# EAGLE design curvetracer (EAGLE 6.4)
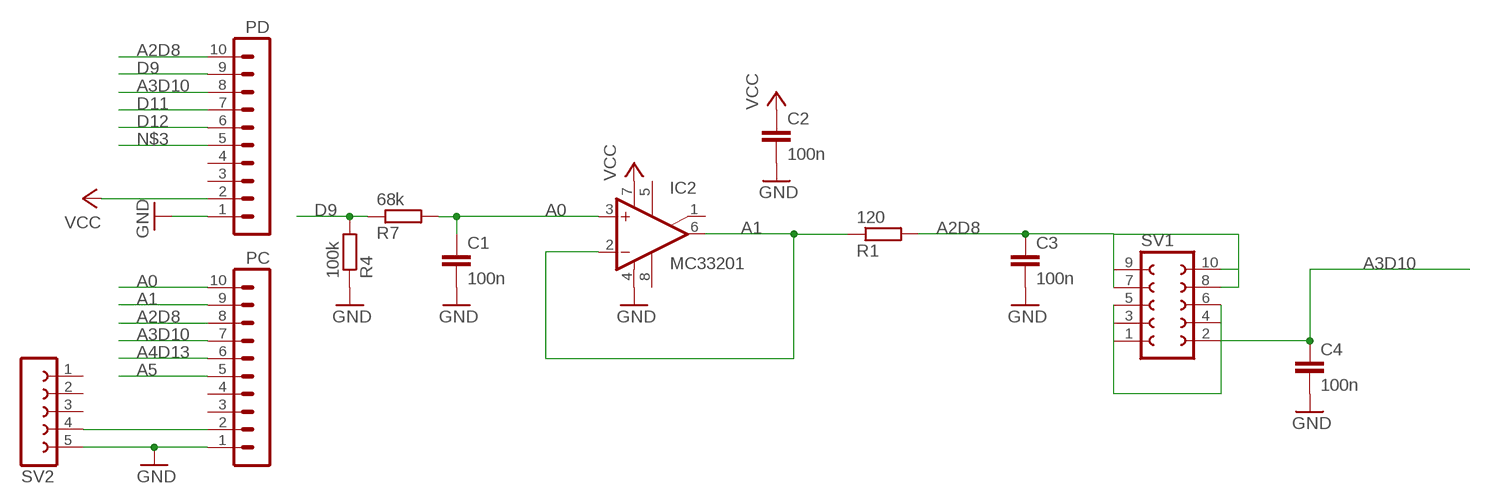
[diagram p0: schematic, sheet 1]

## Parts
C1  100n  C-EU025-024X044  [C025-024X044]
C2  100n  C-EU025-024X044  [C025-024X044]
C3  100n  C-EU075-032X103  [C075-032X103]
C4  100n  C-EU102-043X133  [C102-043X133]
IC2  MC33201  CA3130N  [DIL08]
PC  MA10-1W  [MA10-1W]
PD  MA10-1W  [MA10-1W]
R1  120  R-EU_R1206  [R1206]
R4  100k  R-EU_R1206  [R1206]
R7  68k  R-EU_R1206  [R1206]
SV1  FE05-2W  [FE05-2W]
SV2  FE05W  [FE05W]

## Nets
A0: C1.1 IC2.3(+IN) PC.10 R7.2
A1: IC2.2(-IN) IC2.6(OUT) PC.9 R1.1
A2D8: C3.1 PC.8 PD.10 R1.2 SV1.7 SV1.8 SV1.9 SV1.10
A3D10: C4.1 PC.7 PD.8 SV1.1 SV1.2 SV1.3 SV1.4 SV1.5 SV1.6
A4D13: PC.6
A5: PC.5
D9: PD.9 R4.2 R7.1
D11: PD.7
D12: PD.6
GND: C1.2 C2.2 C3.2 C4.2 IC2.4(V-) PC.1 PD.1 R4.1 SV2.5
N$1: PC.2 SV2.4
N$3: PD.5
VCC: C2.1 IC2.7(V+) PD.2
Unconnected: IC2.1(ON/CMP) IC2.5(ON) IC2.8(CMP) PC.3 PC.4 PD.3 PD.4 SV2.1 SV2.2 SV2.3

## Library data of the parts
C1-C4 = rcl:C-EU: CAPACITOR, European symbol
IC2 = linear:CA3130: OP AMP
PC PD = con-lstb:MA10-1W: PIN HEADER
R1 R4 R7 = rcl:R-EU_: RESISTOR, European symbol
SV1 = con-lsta:FE05-2W: FEMALE HEADER; OC_FARNELL: unknown; OC_NEWARK: unknown
SV2 = con-lsta:FE05W: FEMALE HEADER; OC_FARNELL: unknown; OC_NEWARK: unknown

## Board
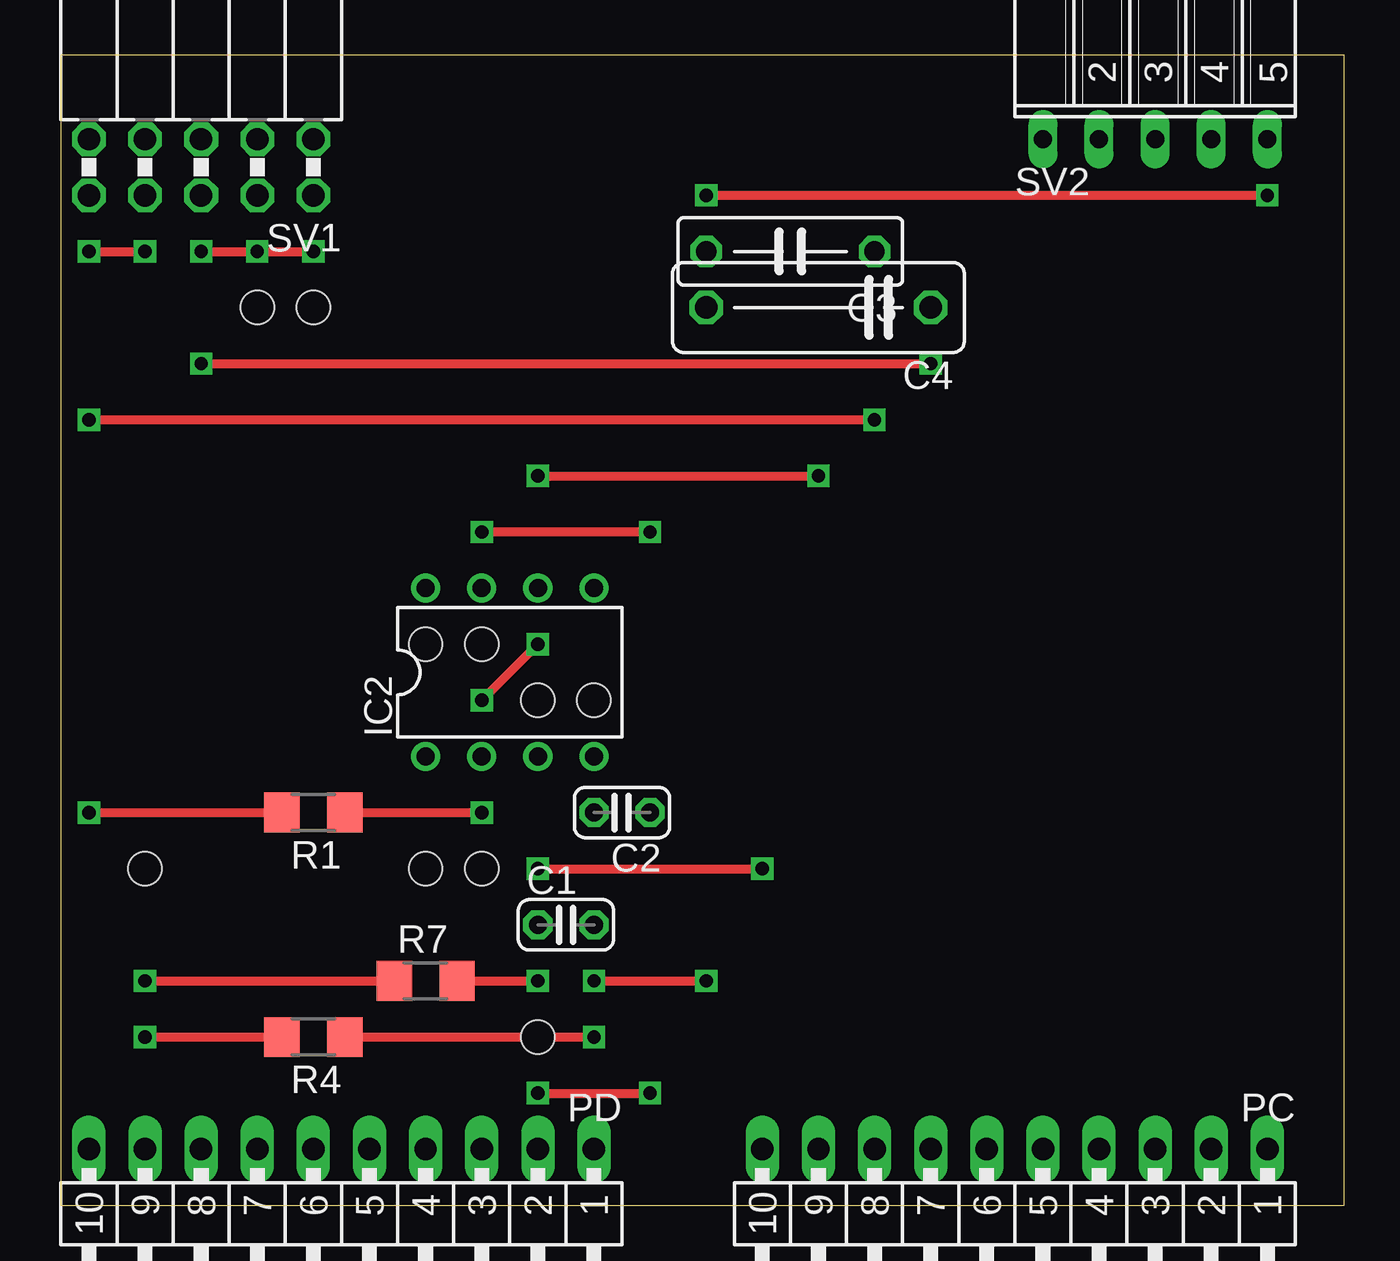
[diagram p1: board, top side]
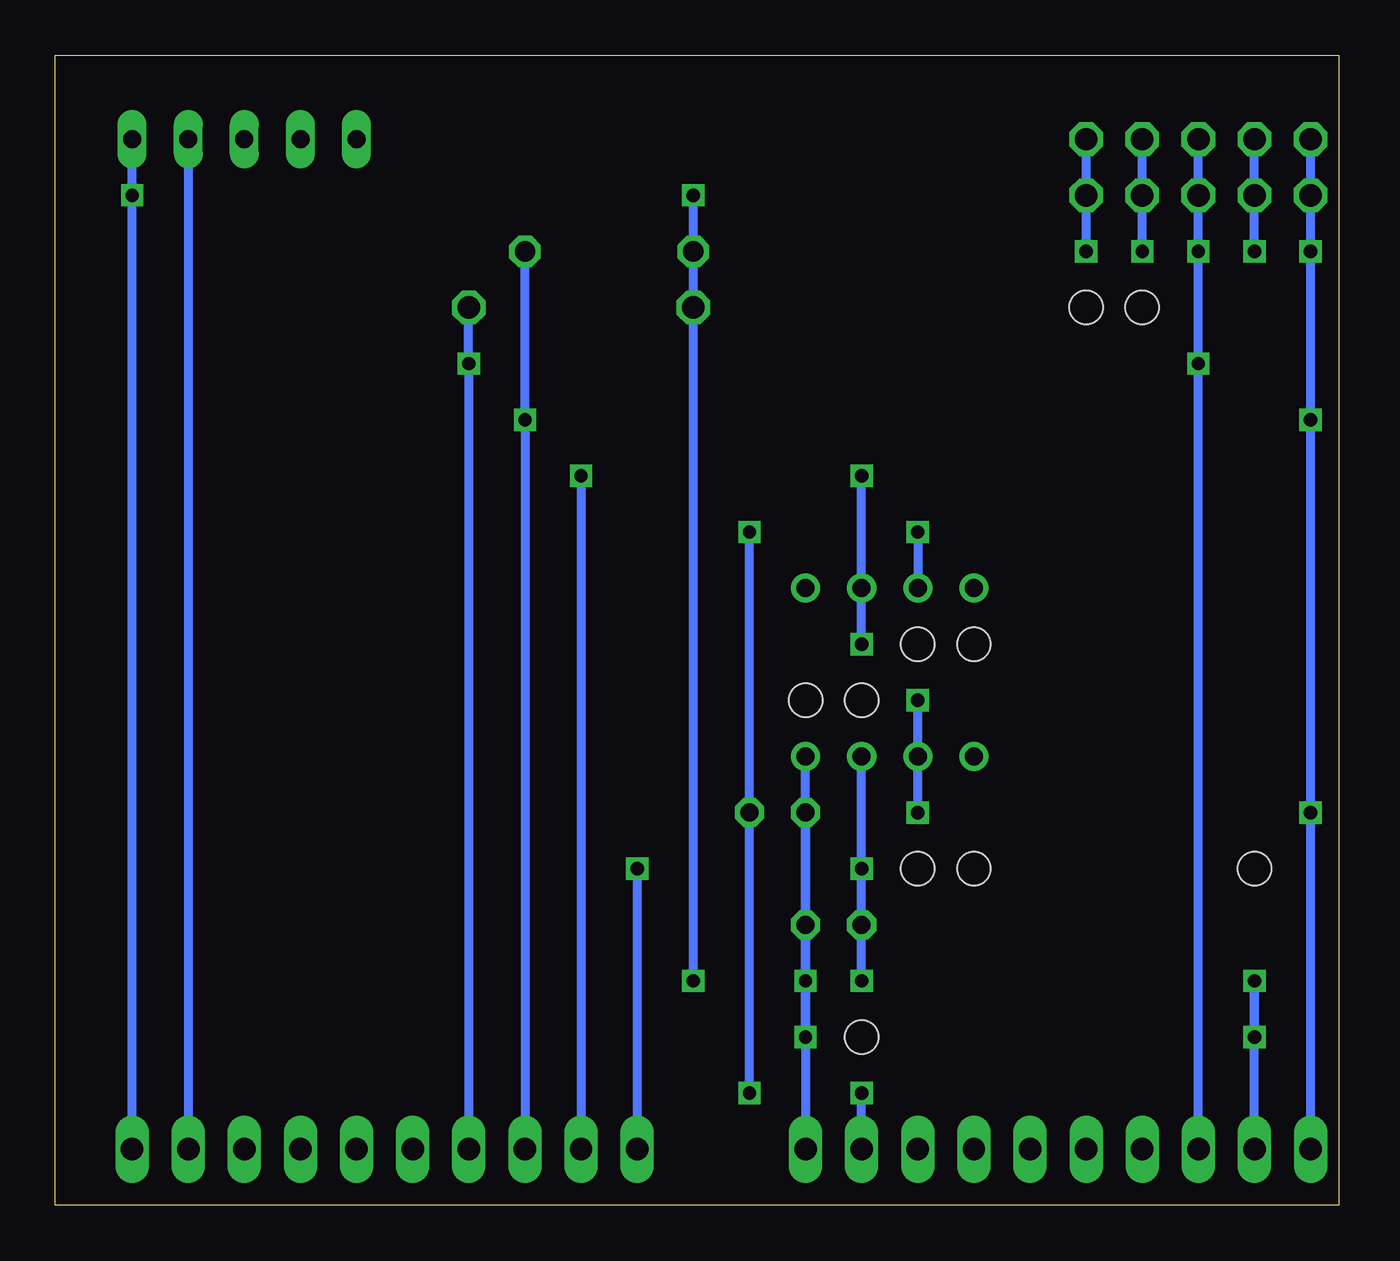
[diagram p2: board, bottom side, seen from below]

Size 58.09 x 52.06 mm. Coordinates in mm from the lower left corner, seen from the top.
Outline: 0,0 58.09,0 58.09,52.06 0,52.06 0,0
Copper layers (1*16): Top 0.035mm / dielectric 1.5mm / Bottom 0.035mm
Design rules "default": minimum track width 10mil, minimum drill 24mil, track to track 8mil, track to pad 8mil, pad to pad 8mil, via to via 8mil, smd to smd 8mil, copper to edge 40mil, drill to drill 8mil, minimum pad ring 10mil, minimum via ring 8mil, stop-mask expansion 4mil, vias tented up to drill 0mil, thermal gap 10mil
Holes 1.5 mm at 3.81,15.24 8.89,40.64 11.43,40.64 16.51,25.4 19.05,25.4 21.59,22.86 24.13,22.86 21.59,7.62 19.05,15.24 16.51,15.24

### Footprints (pad centres in the part's own frame; a part is rotated, then mirrored left to right if it is on the bottom)
C025-024X044 = drill 0.813 octagon: 1 -1.27,0; 2 1.27,0
C075-032X103 = drill 0.914 octagon: 1 -3.81,0; 2 3.81,0
C102-043X133 = drill 1.016 octagon: 1 -5.08,0; 2 5.08,0
DIL08 = drill 0.813 pad 1.27: 1 -3.81,-3.81; 2 -1.27,-3.81; 3 1.27,-3.81; 4 3.81,-3.81; 5 3.81,3.81; 6 1.27,3.81; 7 -1.27,3.81; 8 -3.81,3.81
MA10-1W = drill 1.016 long: 1 -11.43,0; 2 -8.89,0; 3 -6.35,0; 4 -3.81,0; 5 -1.27,0; 6 1.27,0; 7 3.81,0; 8 6.35,0; 9 8.89,0; 10 11.43,0
R1206 = smd 1.6 x 1.803: 1 -1.422,0; 2 1.422,0
FE05-2W = drill 1.016 octagon: 1 -5.08,1.27; 2 -5.08,-1.27; 3 -2.54,1.27; 4 -2.54,-1.27; 5 0,1.27; 6 0,-1.27; 7 2.54,1.27; 8 2.54,-1.27; 9 5.08,1.27; 10 5.08,-1.27
FE05W = drill 0.813 long: 1 -5.08,0; 2 -2.54,0; 3 0,0; 4 2.54,0; 5 5.08,0

### Placement (x,y rotation side)
C1  22.86,12.7 0 top
C2  25.4,17.78 180 top
C3  33.02,43.18 180 top
C4  34.29,40.64 180 top
IC2  20.32,24.13 0 top
PC  43.18,2.54 180 top
PD  12.7,2.54 180 top
R1  11.43,17.78 180 top
R4  11.43,7.62 180 top
R7  16.51,10.16 0 top
SV1  6.35,46.99 180 top
SV2  49.53,48.26 0 top

### Tracks (layer width: path | path; a pad name or v marks a point on that pad's centre or on a via)
A0  (via drill 0.6)
  Top 0.406: R7.2 v21.59,10.16 | v21.59,15.24 v31.75,15.24
  Bottom 0.406: v31.75,15.24 PC.10 | IC2.3 v21.59,15.24 C1.1 v21.59,10.16
A1  (via drill 0.6)
  Top 0.406: v21.59,33.02 v34.29,33.02 | v19.05,22.86 v21.59,25.4 | R1.1 v19.05,17.78
  Bottom 0.406: v34.29,33.02 PC.9 | v21.59,33.02 IC2.6 v21.59,25.4 | v19.05,17.78 IC2.2 v19.05,22.86
A2D8  (via drill 0.6)
  Top 0.406: v1.27,17.78 R1.2 | v1.27,35.56 v36.83,35.56 | v1.27,43.18 v3.81,43.18
  Bottom 0.406: PC.8 v36.83,35.56 C3.1 | PD.10 v1.27,17.78 v1.27,35.56 v1.27,43.18 SV1.9 SV1.10 | v3.81,43.18 SV1.7 SV1.8
A3D10  (via drill 0.6)
  Top 0.406: v6.35,38.1 v39.37,38.1 | v11.43,43.18 v8.89,43.18 v6.35,43.18
  Bottom 0.406: PD.8 v6.35,38.1 v6.35,43.18 SV1.5 SV1.6 | PC.7 v39.37,38.1 C4.1 | v8.89,43.18 SV1.3 SV1.4 | v11.43,43.18 SV1.1 SV1.2
D9  (via drill 0.6)
  Top 0.406: v3.81,10.16 R7.1 | v3.81,7.62 R4.2
  Bottom 0.406: PD.9 v3.81,10.16 v3.81,7.62
GND  (via drill 0.6)
  Top 0.406: R4.1 v24.13,7.62 | v24.13,10.16 v29.21,10.16 | v29.21,45.72 v54.61,45.72
  Bottom 0.406: C2.2 v24.13,10.16 | v24.13,10.16 PD.1 | v24.13,7.62 v24.13,10.16 | v24.13,10.16 C1.2 IC2.4 | v29.21,10.16 C4.2 C3.2 v29.21,45.72 | PC.1 v54.61,45.72 SV2.5
N$1
  Bottom 0.406: SV2.4 PC.2
VCC  (via drill 0.6)
  Top 0.406: v21.59,5.08 v26.67,5.08 | v26.67,30.48 v19.05,30.48
  Bottom 0.406: PD.2 v21.59,5.08 | v19.05,30.48 IC2.7 | v26.67,5.08 C2.1 v26.67,30.48

### Text on the board
doc_purple: CURVE TRACER